# EasyEDA Pro project ProPrj_学生签到系统_2026-04-16.epro

# Schematic Schematic1
Assembly Variant: Basic; Board Name: Board1; Create Date: 2026-04-11; Page Name: P1; Project Name: 学生签到系统; Schematic Name: Schematic1; Update Date: 2026-04-11; BladeWidth: 10; Company: 嘉立创EDA; Page Size: A4; RegionStart: 1; ShowBorder: 1; TitleBlock: 1; TitleBlockPosition: 3; Version: V1.0; XRegionCount: 6; YRegionCount: 4
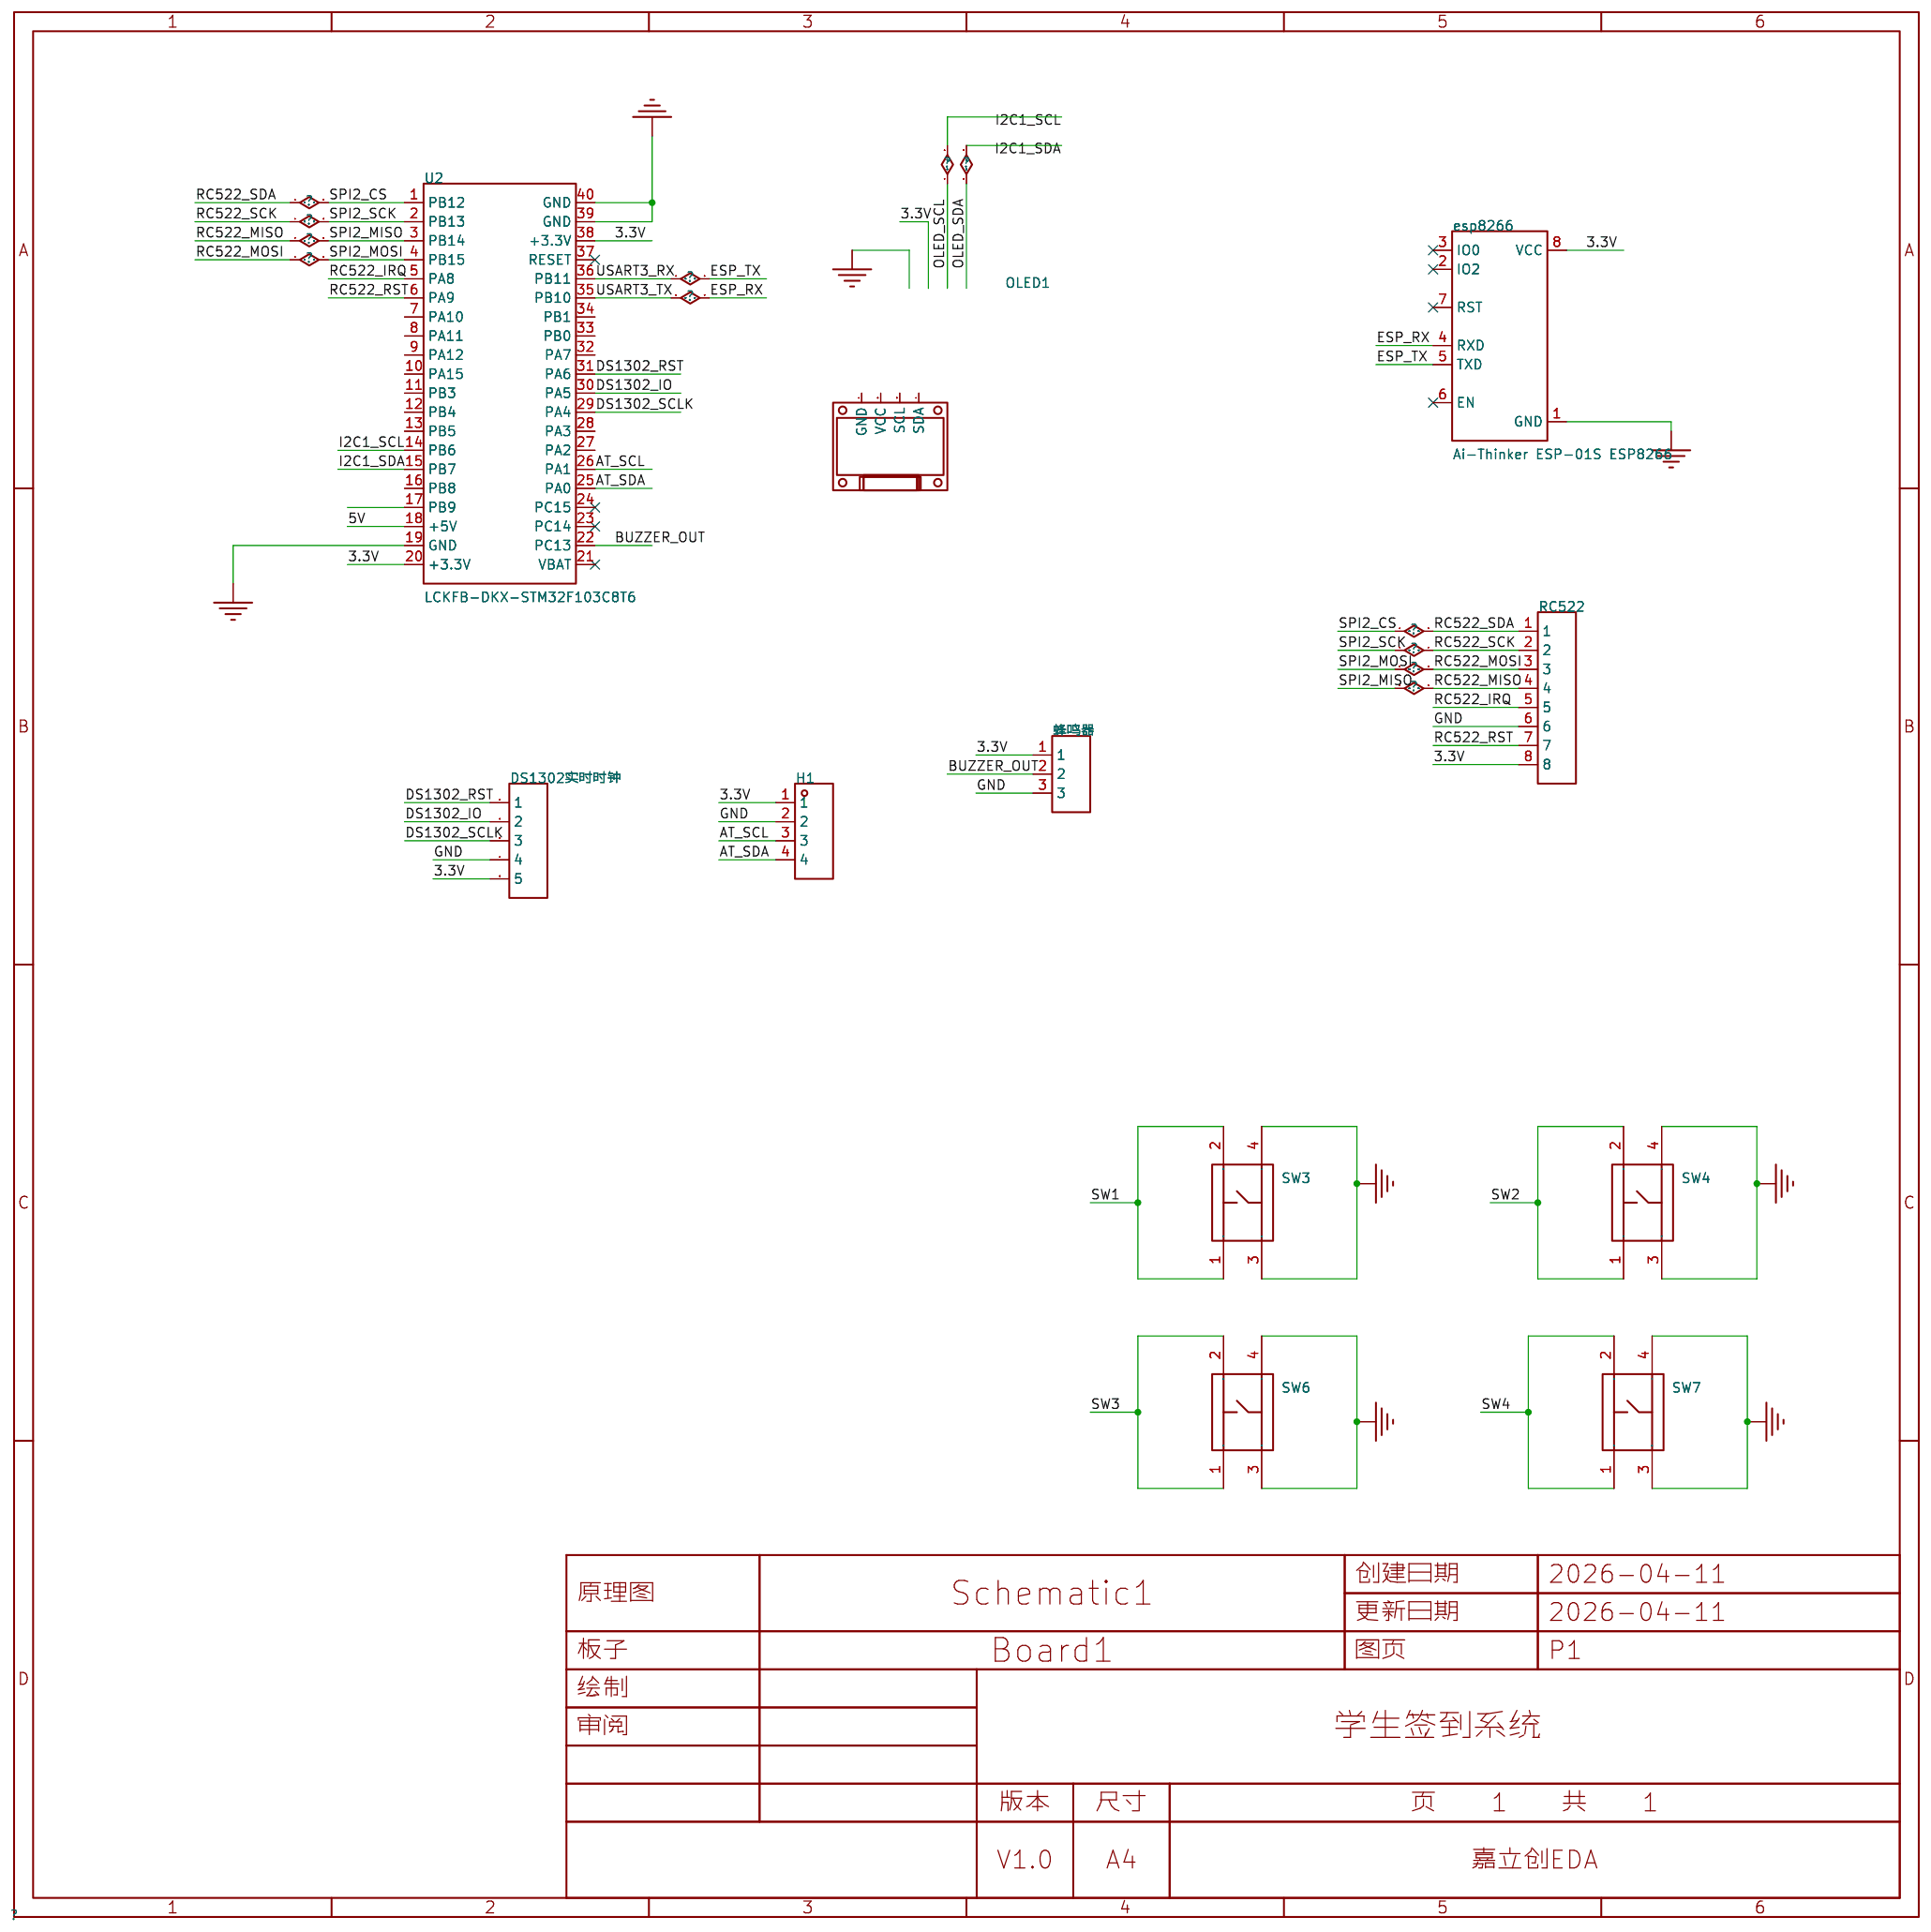
[diagram p0: schematic sheet]

## Parts
DS1302实时时钟  2.54-1*5P母  [HDR-TH_5P-P2.54-V-F]
esp8266  Ai-Thinker ESP-01S ESP8266  [WIFIM-TH_8P-L24.7-W14.4-P2.54]
H1  -  [HDR-TH_4P-P2.54-V-F]
OLED1  -  [0.96OLED_4P]
RC522  -  [HDR-TH_8P-P2.54-V-F-1]
SW3  K2-1102DP-C4SW-04  [KEY-TH_4P-L6.0-W6.0-P4.50-LS6.50]
SW4  K2-1102DP-C4SW-04  [KEY-TH_4P-L6.0-W6.0-P4.50-LS6.50]
SW6  K2-1102DP-C4SW-04  [KEY-TH_4P-L6.0-W6.0-P4.50-LS6.50]
SW7  K2-1102DP-C4SW-04  [KEY-TH_4P-L6.0-W6.0-P4.50-LS6.50]
U2  LCKFB-DKX-STM32F103C8T6  [CONN-TH_L53.3-W22.9_STM32F103C8T6-CARD]
蜂鸣器  -  [HDR-TH_3P-P2.54-V-F]

## Library data of the parts
DS1302实时时钟 = 2.54-1*5P母: 插孔结构:1x5P;间距:2.54mm;行距:-;圆孔/方孔:方孔;安装方式:直插;排数:单排;总孔位数:5P;额定电流:3A;插孔方向:顶部;塑高:8.5mm;触头材质:黄铜;触头镀层:金;工作温度:-55℃~+105℃;; LCSC Part Name: 1x5P 间距:2.54mm 直插; Supplier Part: C50950; Manufacturer: BOOMELE(博穆精密); Supplier Footprint: 插件,P=2.54mm; JLCPCB Part Class: Extended Part; Datasheet: https://item.szlcsc.com/datasheet/2.54-1*5P%25E6%25AF%258D/51962.html; Supplier: LCSC; Holes Structure: 1x5P; Pitch: 2.54mm; Circular Hole / Square Hole: 方孔; Mounting Type: 直插; Number of Rows: 单排; Number of Positions: 5P; Current Rating: 3A; Holes Direction: 顶部; Insulation Height: 8.5mm; Contact Material: 黄铜; Contact Plating: 金; Operating Temperature: -55℃~+105℃; PIN Length: 3.2mm
esp8266 = Ai-Thinker ESP-01S ESP8266: Supplier Part: C17606792; Manufacturer: Ai-Thinker(安信可); JLCPCB Part Class: Extended Part; Datasheet: https://item.szlcsc.com/datasheet/Ai-Thinker%2520ESP-01S%2520ESP8266/18736031.html; Supplier: LCSC
H1 = HDR-F_2.54_1x4P: Supplier Part: C2718488; Supplier Footprint: 插件
OLED1 = 0.96OLED模块_4P: Supplier Footprint: 插件
RC522 = HDR-F_2.54_1x8P: Supplier Part: C27438; Supplier Footprint: 插件
SW3 SW4 SW6 SW7 = K2-1102DP-C4SW-04: 电路结构:单刀单掷;按钮形状:圆形按钮;作用力:2.5N;安装方式:直插;开关长度:6mm;开关宽度:6mm;开关高度:5mm;触点电流:50mA;额定电压:12V;带灯:-;工作寿命:10万次;; LCSC Part Name: 轻触按键开关6*6*5; Supplier Part: C110153; Manufacturer: 韩国韩荣; Supplier Footprint: 插件-4P,6x6mm; JLCPCB Part Class: Extended Part; Datasheet: https://item.szlcsc.com/datasheet/K2-1102DP-C4SW-04/111374.html; Supplier: LCSC; Circuit: 单刀单掷; Actuator Style: 圆形按钮; Operating Force: 2.5N; Mounting Type: 直插; Length: 6mm; Width: 6mm; Switch Height: 5mm; Contact Current: 50mA; Voltage Rating: 12V; Life: 10万次; Operating Temperature: -25℃~+85℃
U2 = LCKFB-DKX-STM32F103C8T6: 搭载Contex M3内核,程序存储容量64KB,RAM总容量20KB,最高72MHz主频,提供高效的计算能力和稳定的运行环境。; LCSC Part Name: 立创·地阔星-STM32F103C8T6开发板; Supplier Part: C22396880; Manufacturer: 立创开发板; JLCPCB Part Class: Extended Part; Datasheet: https://item.szlcsc.com/datasheet/LCKFB-DKX-STM32F103C8T6/24005615.html; Supplier: LCSC
蜂鸣器 = HDR-F_2.54_1x3P: Supplier Part: C541850; Supplier Footprint: 插件

## Nets
3.3V: DS1302实时时钟.5 esp8266.8(VCC) H1.1 RC522.8 U2.20(+3.3V) U2.38(+3.3V) 蜂鸣器.1
5V: U2.18(+5V)
GND: DS1302实时时钟.4 esp8266.1(GND) H1.2 RC522.6 SW3.3 SW3.4 SW4.3 SW4.4 SW6.3 SW6.4 SW7.3 SW7.4 U2.19(GND) U2.39(GND) U2.40(GND) 蜂鸣器.3
AT_SCL: H1.3 U2.26(PA1)
AT_SDA: H1.4 U2.25(PA0)
BUZZER_OUT: U2.22(PC13) 蜂鸣器.2
DS1302_IO: DS1302实时时钟.2 U2.30(PA5)
DS1302_RST: DS1302实时时钟.1 U2.31(PA6)
DS1302_SCLK: DS1302实时时钟.3 U2.29(PA4)
ESP_RX: esp8266.4(RXD) U2.35(PB10)
ESP_TX: esp8266.5(TXD) U2.36(PB11)
I2C1_SCL: U2.14(PB6)
I2C1_SDA: U2.15(PB7)
RC522_IRQ: RC522.5 U2.5(PA8)
RC522_MISO: RC522.4 U2.3(PB14)
RC522_MOSI: RC522.3 U2.4(PB15)
RC522_RST: RC522.7 U2.6(PA9)
RC522_SCK: RC522.2 U2.2(PB13)
RC522_SDA: RC522.1 U2.1(PB12)
SW1: SW3.1 SW3.2
SW2: SW4.1 SW4.2
SW3: SW6.1 SW6.2
SW4: SW7.1 SW7.2

Not connected (* = marked no-connect by the designer): esp8266 2(IO2)* 3(IO0)* 6(EN)* 7(RST)*; OLED1 1(GND) 2(VCC) 3(SCL) 4(SDA); U2 7(PA10) 8(PA11) 9(PA12) 10(PA15) 11(PB3) 12(PB4) 13(PB5) 16(PB8) 17(PB9) 21(VBAT)* 23(PC14)* 24(PC15)* 27(PA2) 28(PA3) 32(PA7) 33(PB0) 34(PB1) 37(RESET)*

# Board PCB1
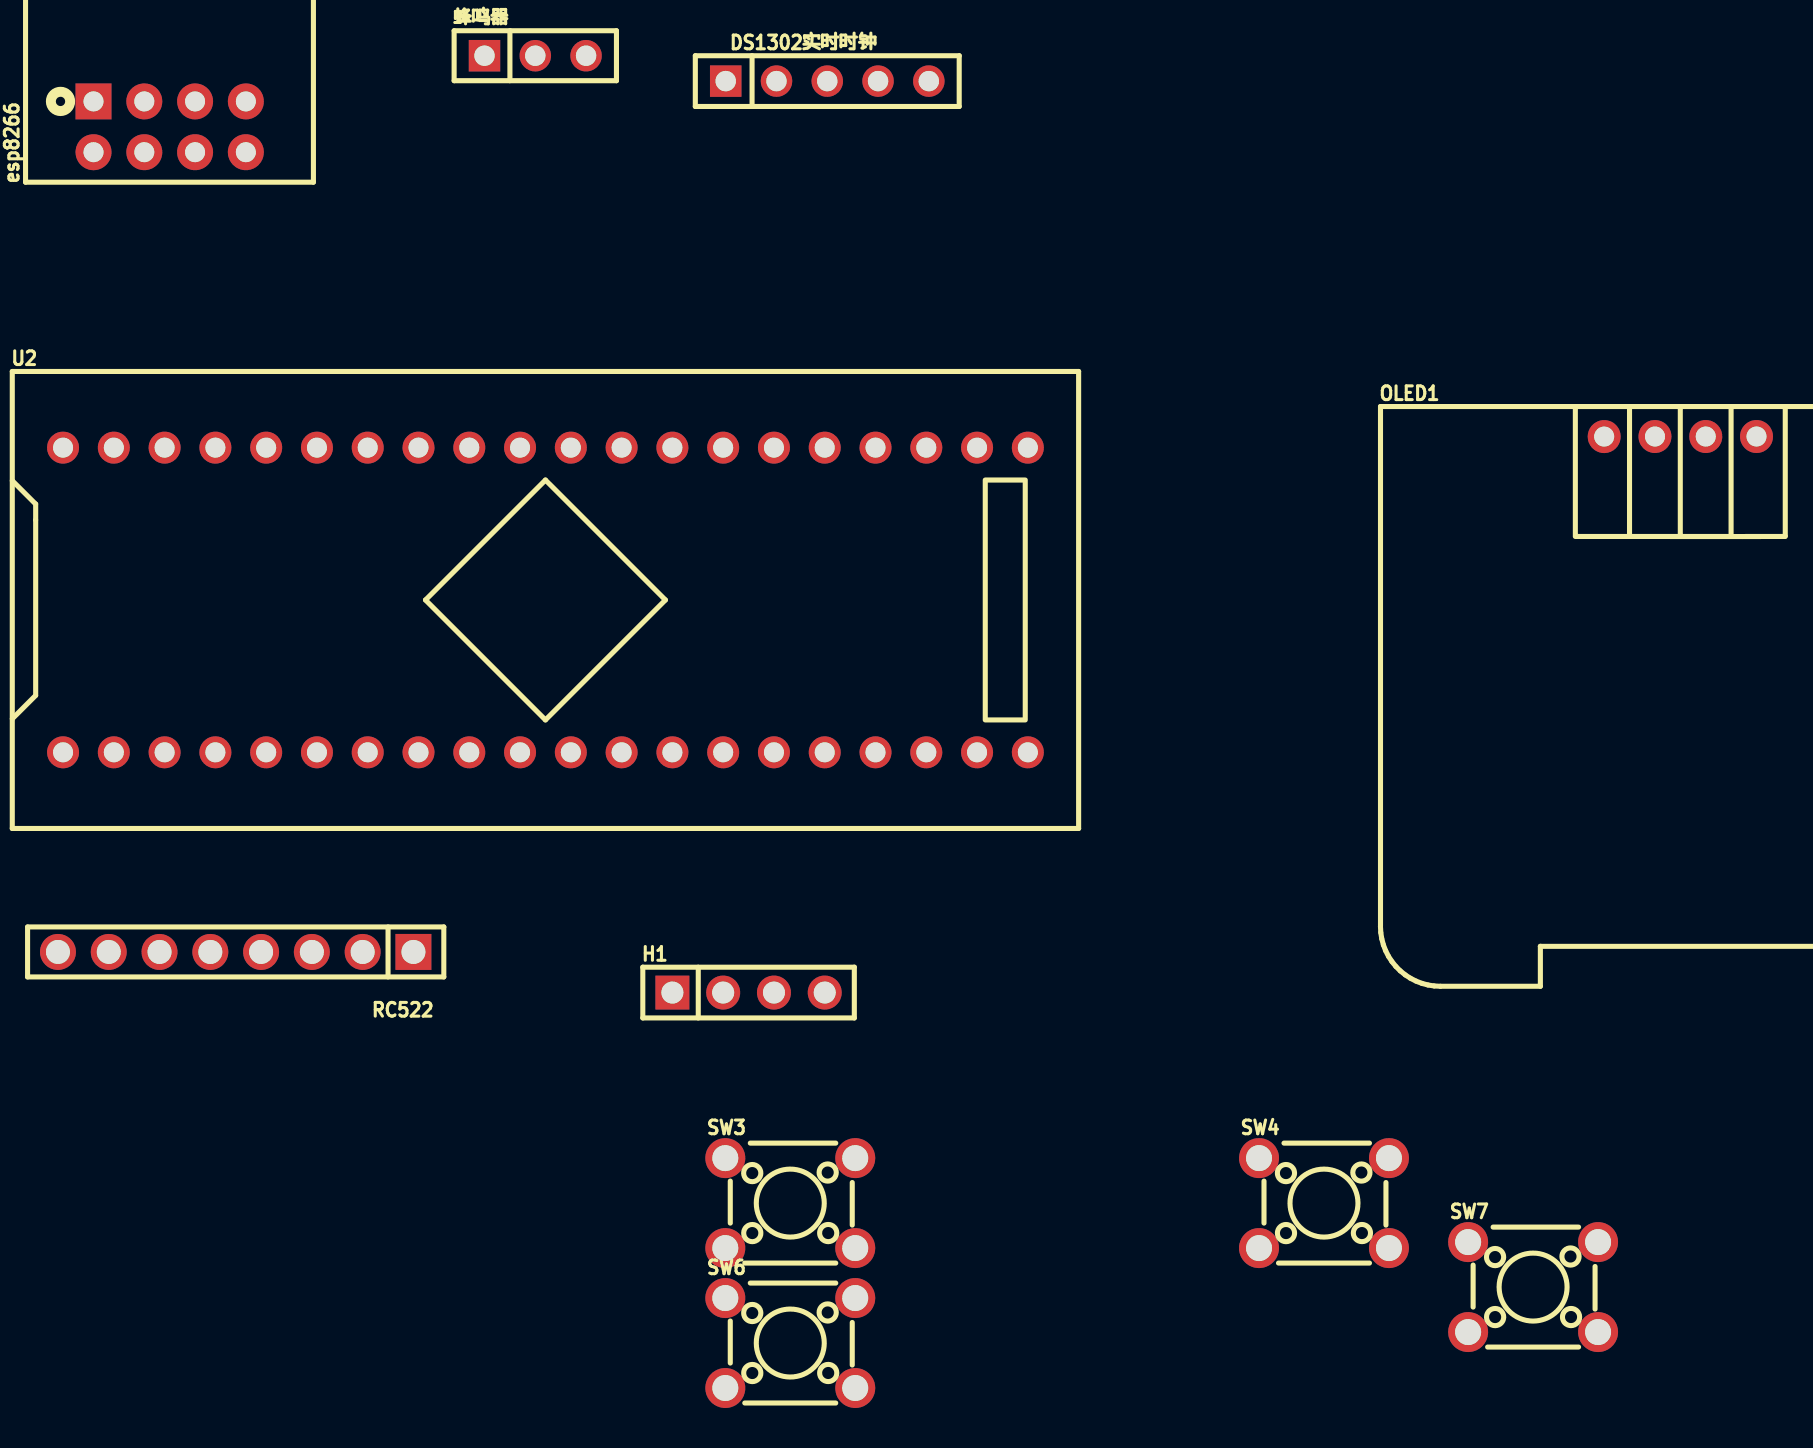
[diagram p1: board, top side]
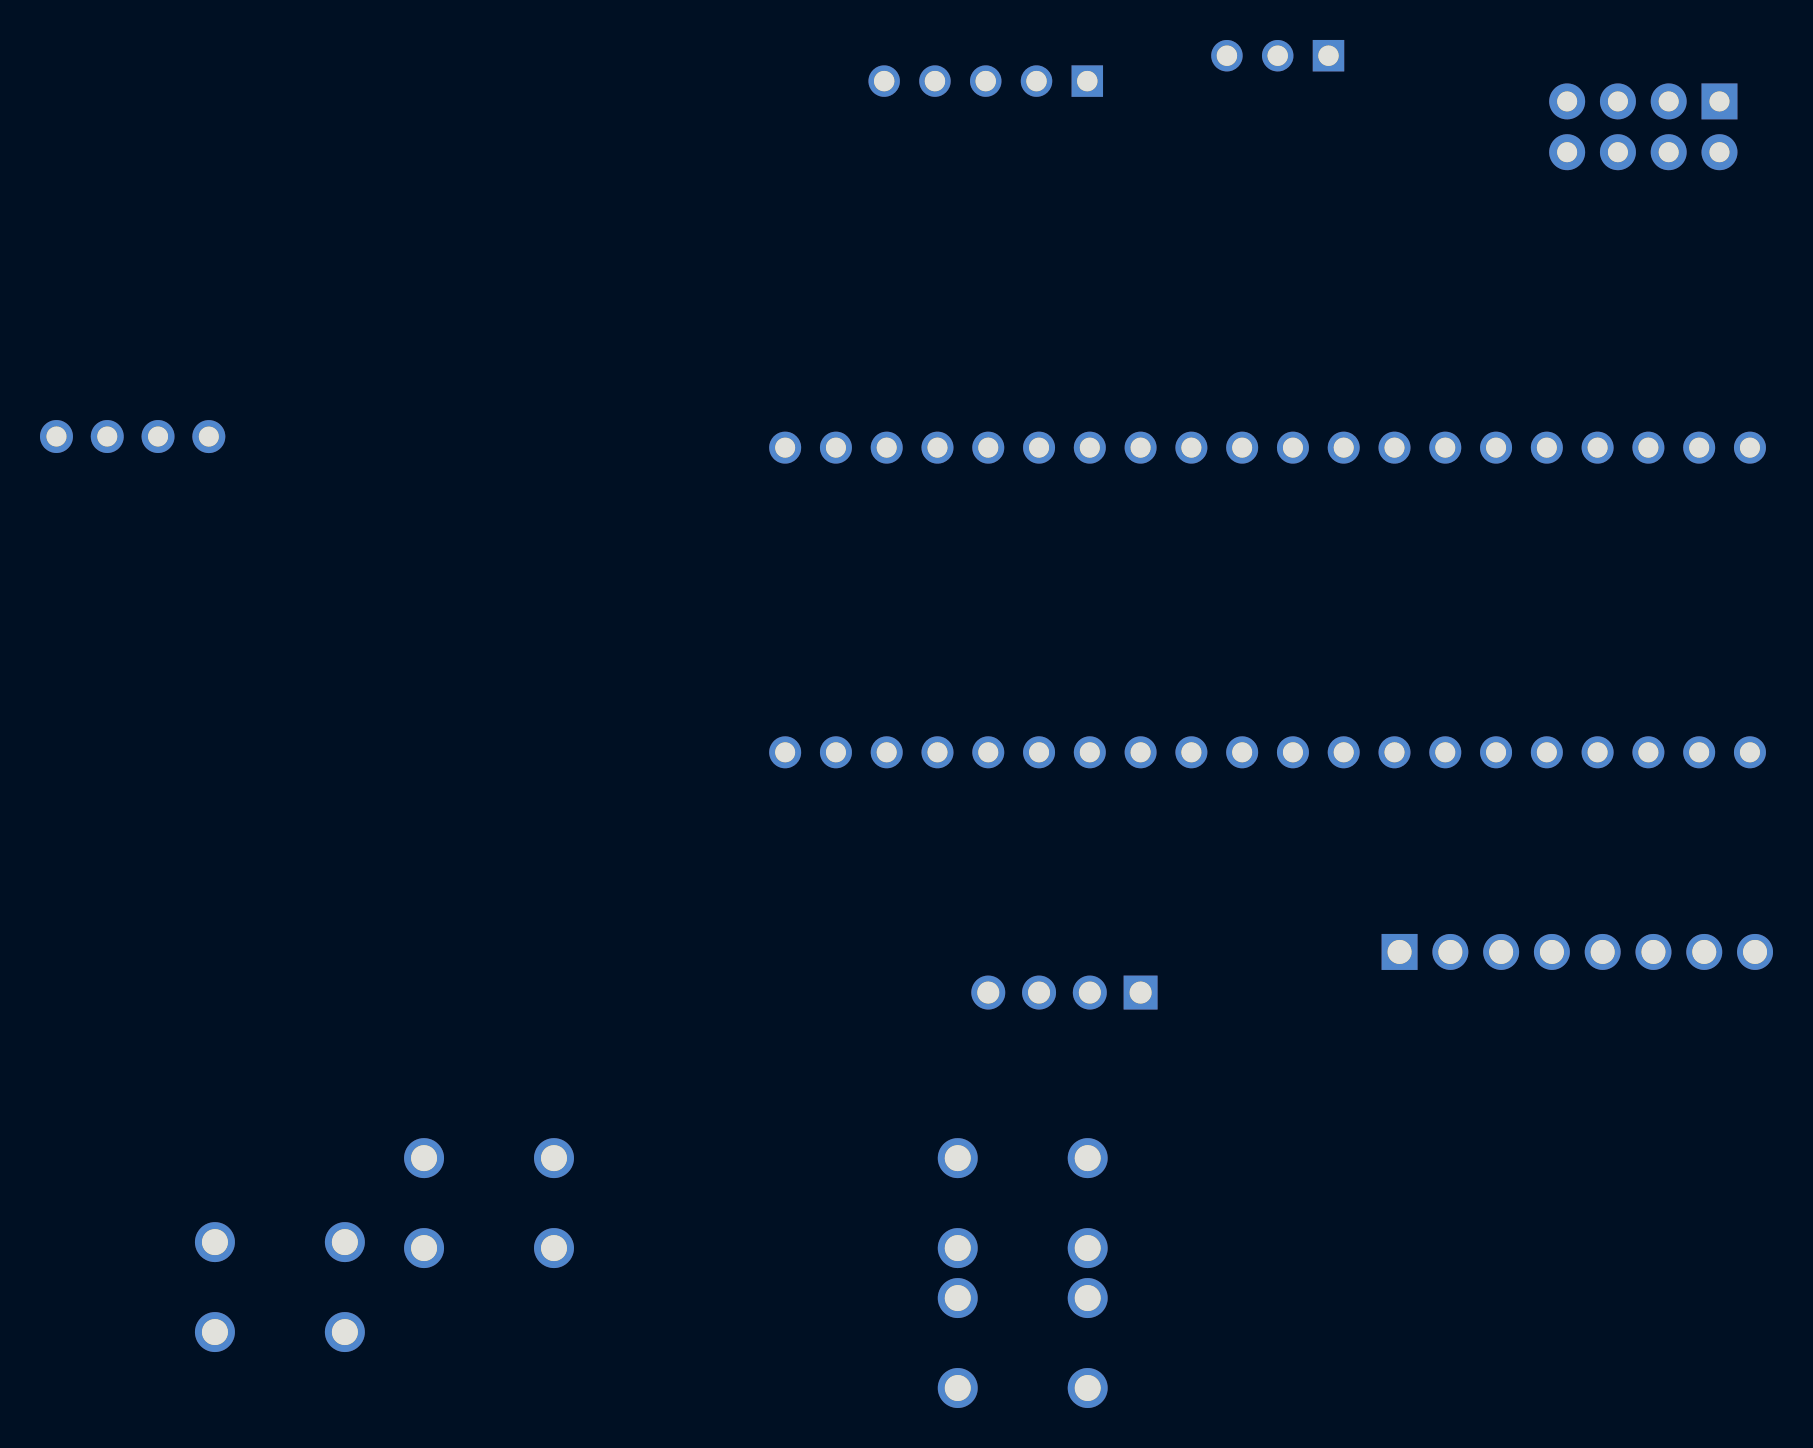
[diagram p2: board, bottom side, seen from below]

No outline. copper layers: Top Layer, Bottom Layer. Coordinates in mm from the lowest, leftmost part position.
Stack: Top Layer 0.035mm / Dielectric1 1.51mm FR4 er 4.5 / Bottom Layer 0.035mm

## Design rules (mm)
spacing copperThickness1oz (default): track to track 0.102, other pairs 0.152 to 0.3
spacing copperThickness2oz: track to track 0.203, other pairs 0.152 to 0.3
track width copperThickness1oz (default): min 0.127, default 0.254, max 2.54
track width copperThickness2oz: min 0.203, default 0.254, max 2.54
differential pair differentialPair (default): width min 0.127, default 0.254, max 2.54; gap min 0.152, default 0.152

## Placement (name value [footprint] x y rotation side)
DS1302实时时钟  2.54-1*5P母  [HDR-TH_5P-P2.54-V-F]  32.89 63.12 0 top
esp8266  Ai-Thinker ESP-01S ESP8266  [WIFIM-TH_8P-L24.7-W14.4-P2.54]  0 60.84 90 top
H1  -  [HDR-TH_4P-P2.54-V-F]  28.96 17.53 0 top
OLED1  -  [0.96OLED_4P]  75.56 45.34 0 top
RC522  -  [HDR-TH_8P-P2.54-V-F-1]  3.3 19.56 180 top
SW3  K2-1102DP-C4SW-04  [KEY-TH_4P-L6.0-W6.0-P4.50-LS6.50]  31.04 7 0 top
SW4  K2-1102DP-C4SW-04  [KEY-TH_4P-L6.0-W6.0-P4.50-LS6.50]  57.74 7 0 top
SW6  K2-1102DP-C4SW-04  [KEY-TH_4P-L6.0-W6.0-P4.50-LS6.50]  31.04 0 0 top
SW7  K2-1102DP-C4SW-04  [KEY-TH_4P-L6.0-W6.0-P4.50-LS6.50]  68.2 2.8 0 top
U2  LCKFB-DKX-STM32F103C8T6  [CONN-TH_L53.3-W22.9_STM32F103C8T6-CARD]  18.8 37.17 0 top
蜂鸣器  -  [HDR-TH_3P-P2.54-V-F]  18.29 64.39 0 top

## Footprints (pads in the part's own frame, mm; a bottom-side part is the same pattern mirrored in y, then rotated)
0.96OLED_4P
  round 1.65 hole 1: 1(-3.81,-0.002) 2(-1.27,0.002) 3(1.27,0.002) 4(3.81,0.002)
CONN-TH_L53.3-W22.9_STM32F103C8T6-CARD
  round 1.6 hole 1: 1(-24.13,-7.62) 2(-21.59,-7.62) 3(-19.05,-7.62) 4(-16.51,-7.62) 5(-13.97,-7.62) 6(-11.43,-7.62) 7(-8.89,-7.62) 8(-6.35,-7.62) 9(-3.81,-7.62) 10(-1.27,-7.62) 11(1.27,-7.62) 12(3.81,-7.62) 13(6.35,-7.62) 14(8.89,-7.62) 15(11.43,-7.62) 16(13.97,-7.62) 17(16.51,-7.62) 18(19.05,-7.62) 19(21.59,-7.62) 20(24.13,-7.62) 21(24.13,7.62) 22(21.59,7.62) 23(19.05,7.62) 24(16.51,7.62) 25(13.97,7.62) 26(11.43,7.62) 27(8.89,7.62) 28(6.35,7.62) 29(3.81,7.62) 30(1.27,7.62) 31(-1.27,7.62) 32(-3.81,7.62) 33(-6.35,7.62) 34(-8.89,7.62) 35(-11.43,7.62) 36(-13.97,7.62) 37(-16.51,7.62) 38(-19.05,7.62) 39(-21.59,7.62) 40(-24.13,7.62)
HDR-TH_3P-P2.54-V-F
  rect 1.575x1.575 hole 1.02: 1(-2.54,0)
  round 1.575 hole 1.02: 2(0,0) 3(2.54,0)
HDR-TH_4P-P2.54-V-F
  rect 1.7x1.7 hole 1.1: 1(-3.81,0)
  round 1.7 hole 1.1: 2(-1.27,0) 3(1.27,0) 4(3.81,0)
HDR-TH_5P-P2.54-V-F
  rect 1.575x1.575 hole 1.02: 1(-5.08,0)
  round 1.575 hole 1.02: 2(-2.54,0) 3(0,0) 4(2.54,0) 5(5.08,0)
HDR-TH_8P-P2.54-V-F-1
  rect 1.8x1.8 hole 1.2: 1(-8.89,0)
  round 1.8 hole 1.2: 2(-6.35,0) 3(-3.81,0) 4(-1.27,0) 5(1.27,0) 6(3.81,0) 7(6.35,0) 8(8.89,0)
KEY-TH_4P-L6.0-W6.0-P4.50-LS6.50
  round 2 hole 1.3: 1(-3.25,2.25) 2(3.25,2.25) 3(-3.25,-2.25) 4(3.25,-2.25)
WIFIM-TH_8P-L24.7-W14.4-P2.54
  rect 1.8x1.8 hole 1: 1(1.27,3.81)
  round 1.8 hole 1: 2(1.27,1.27) 3(1.27,-1.27) 4(1.27,-3.81) 5(-1.27,3.81) 6(-1.27,1.27) 7(-1.27,-1.27) 8(-1.27,-3.81)

## Nets
3.3V: DS1302实时时钟.5 esp8266.8 H1.1 OLED1.2 RC522.8 U2.20 U2.38 蜂鸣器.1
5V: U2.18
GND: DS1302实时时钟.4 esp8266.1 H1.2 OLED1.1 RC522.6 SW3.3 SW3.4 SW4.3 SW4.4 SW6.3 SW6.4 SW7.3 SW7.4 U2.19 U2.39 U2.40 蜂鸣器.3
AT_SCL: H1.3
AT_SDA: H1.4
BUZZER_OUT: U2.32 蜂鸣器.2
DS1302_IO: DS1302实时时钟.2 U2.28
DS1302_RST: DS1302实时时钟.1 U2.29
DS1302_SCLK: DS1302实时时钟.3 U2.27
ESP_RX: esp8266.4 U2.35
ESP_TX: esp8266.5 U2.36
I2C1_SCL: OLED1.3 U2.14
I2C1_SDA: OLED1.4 U2.15
RC522_IRQ: RC522.5 U2.5
RC522_MISO: RC522.4 U2.3
RC522_MOSI: RC522.3 U2.4
RC522_RST: RC522.7 U2.6
RC522_SCK: RC522.2 U2.2
RC522_SDA: RC522.1 U2.1
SW1: SW3.1 SW3.2
SW2: SW4.1 SW4.2
SW3: SW6.1 SW6.2
SW4: SW7.1 SW7.2
$1N8: U2.17

Pads without a net: esp8266 2 3 6 7; U2 7 8 9 10 11 12 13 16 21 22 23 24 25 26 30 31 33 34 37
